# Altium schematic sheet Sheet3.SchDoc
size A2; SheetNumber: 3; SheetTotal: 6
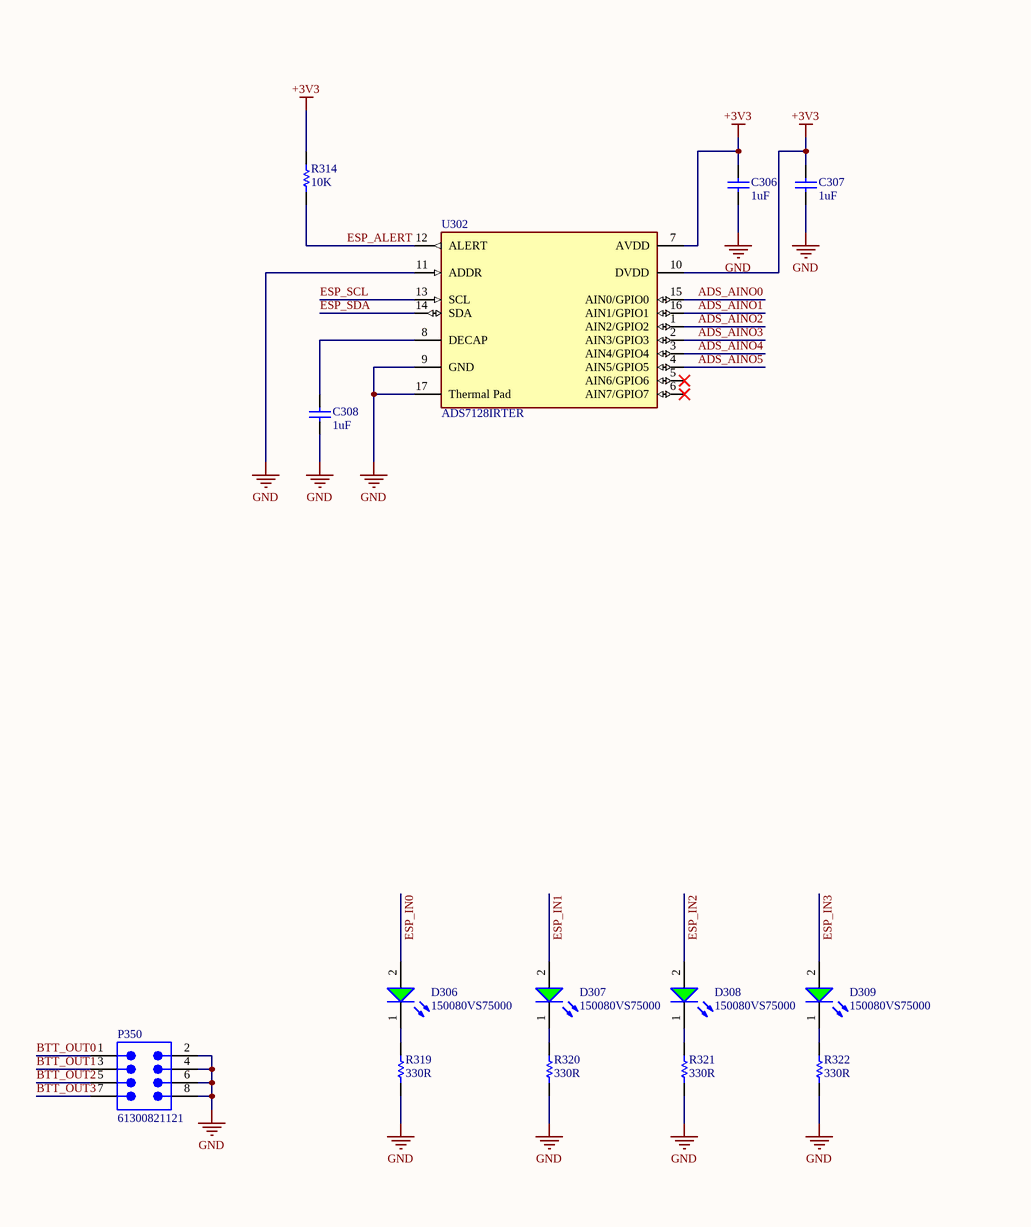
[diagram p0: Sheet3.SchDoc, left]
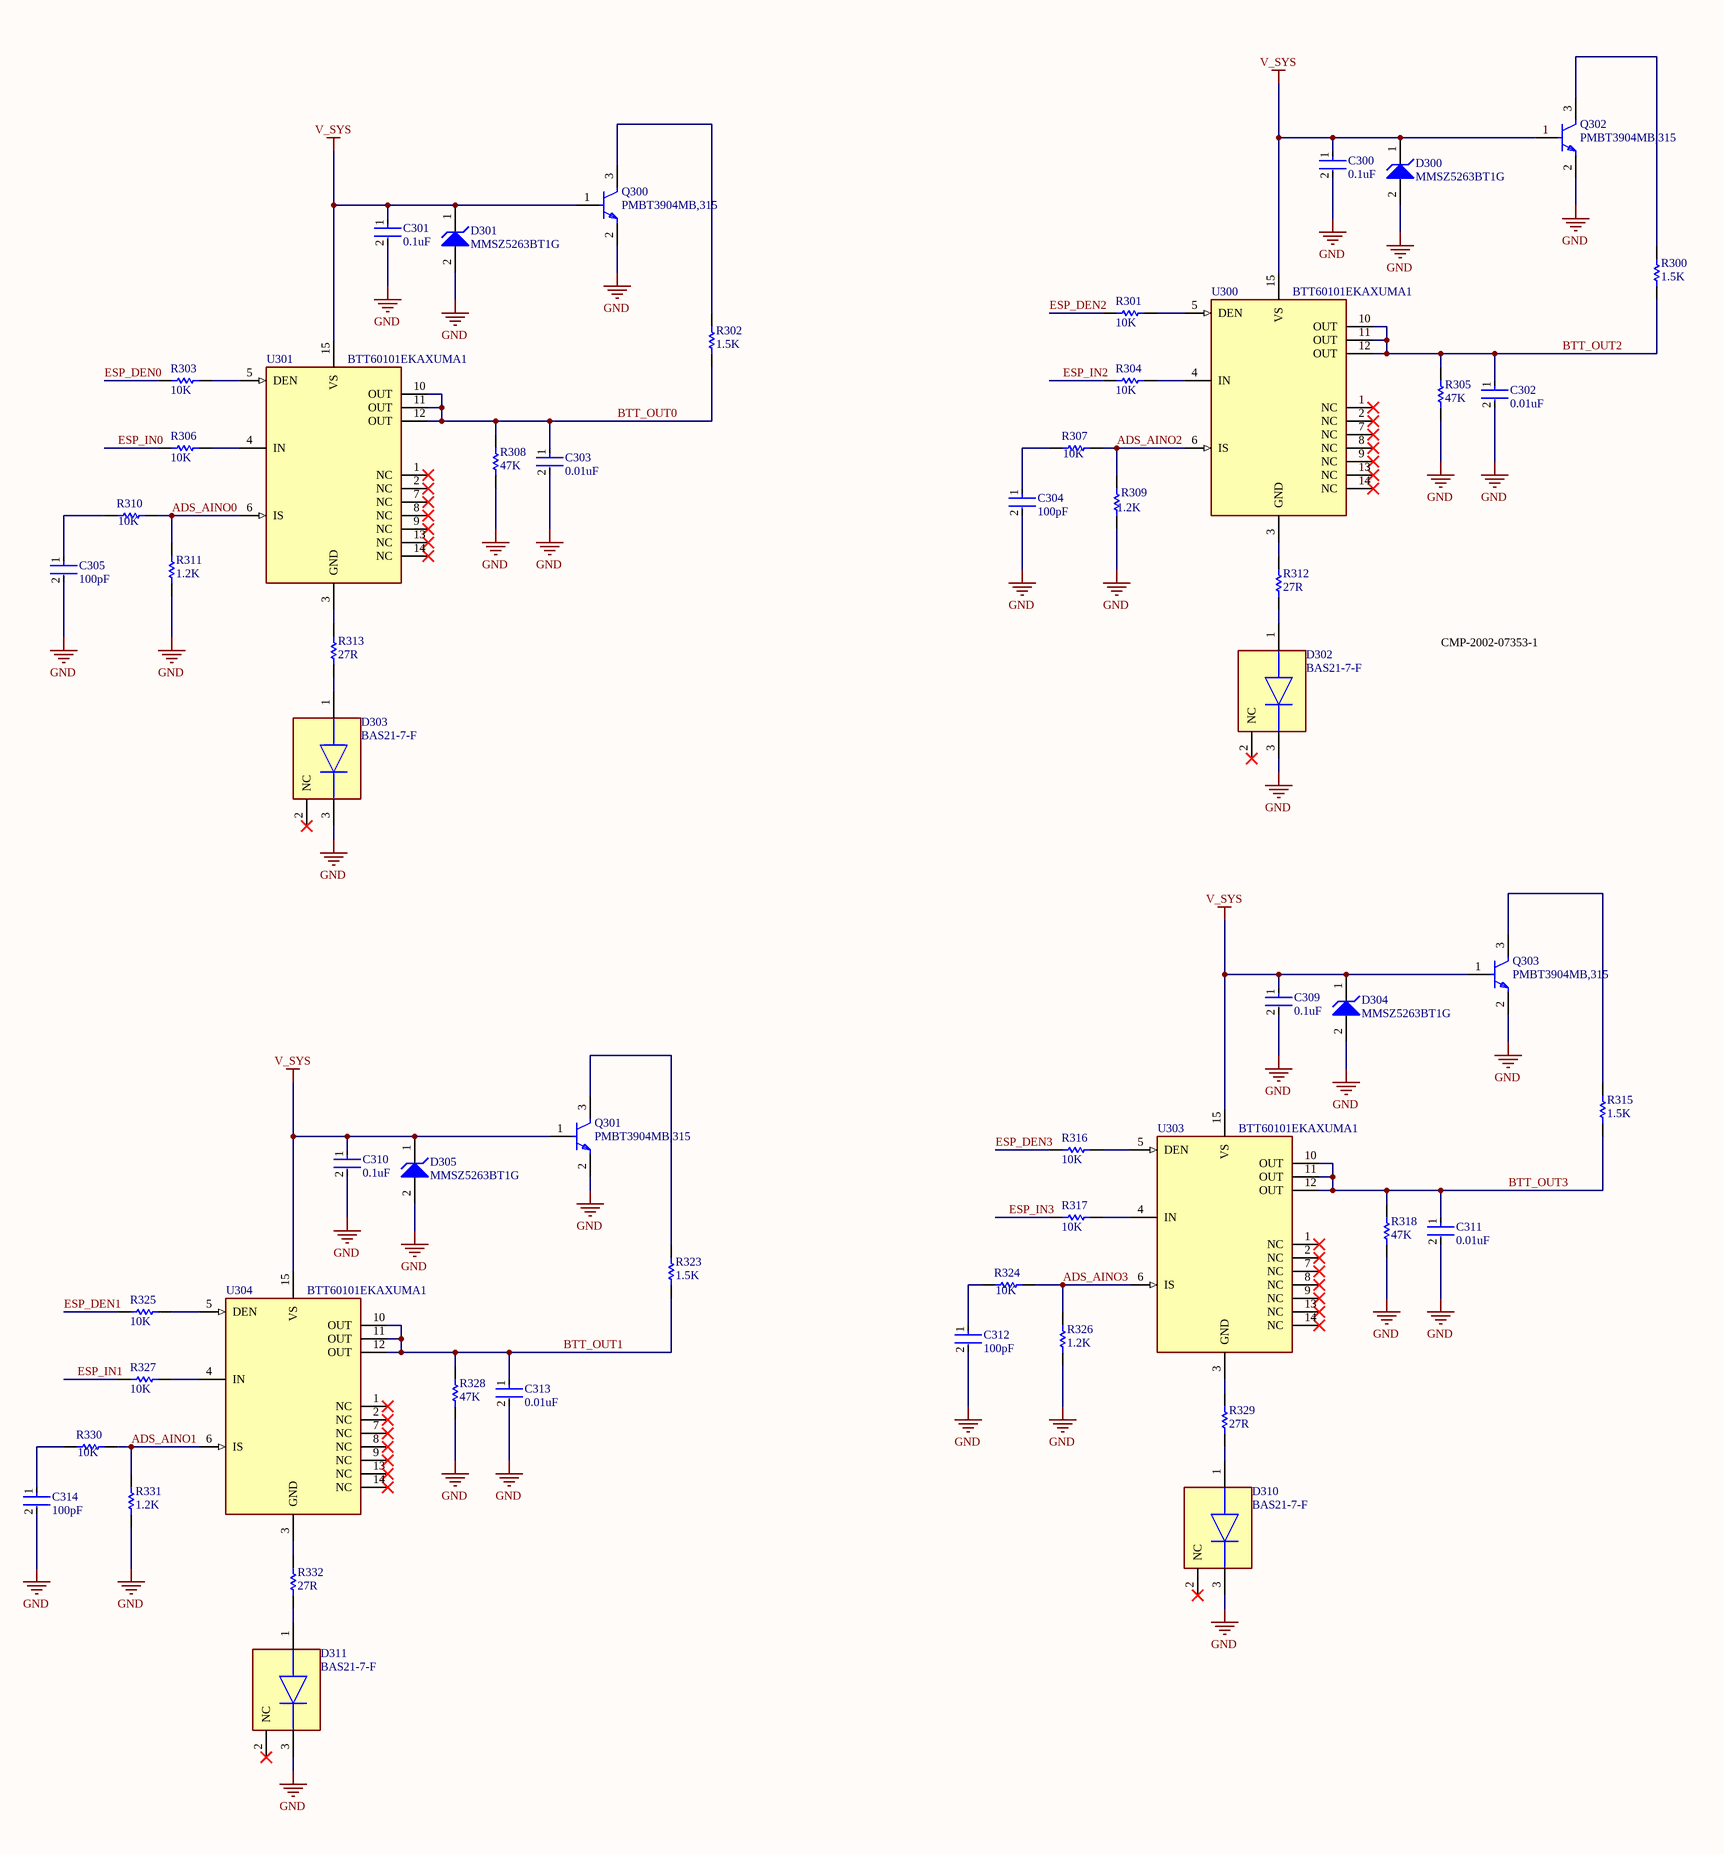
[diagram p1: Sheet3.SchDoc, right]

## Parts
C300  0.1uF  [FP-GRM155-0_05-IPC_B]
C301  0.1uF  [FP-GRM155-0_05-IPC_B]
C302  0.01uF  [FP-GRM155-0_05-IPC_C]
C303  0.01uF  [FP-GRM155-0_05-IPC_C]
C304  100pF  [FP-C0402-BB-MFG]
C305  100pF  [FP-C0402-BB-MFG]
C306  1uF  [CAPC1608X90X35LL10T15]
C307  1uF  [CAPC1608X90X35LL10T15]
C308  1uF  [CAPC1608X90X35LL10T15]
C309  0.1uF  [FP-GRM155-0_05-IPC_B]
C310  0.1uF  [FP-GRM155-0_05-IPC_B]
C311  0.01uF  [FP-GRM155-0_05-IPC_C]
C312  100pF  [FP-C0402-BB-MFG]
C313  0.01uF  [FP-GRM155-0_05-IPC_C]
C314  100pF  [FP-C0402-BB-MFG]
D300  MMSZ5263BT1G  [ONSC-SOD-123-2-425-04_V]
D301  MMSZ5263BT1G  [ONSC-SOD-123-2-425-04_V]
D302  BAS21-7-F  [FP-SOT23-MFG]
D303  BAS21-7-F  [FP-SOT23-MFG]
D304  MMSZ5263BT1G  [ONSC-SOD-123-2-425-04_V]
D305  MMSZ5263BT1G  [ONSC-SOD-123-2-425-04_V]
D306  150080VS75000  [WL-SMCW_0805_150080xx75000]
D307  150080VS75000  [WL-SMCW_0805_150080xx75000]
D308  150080VS75000  [WL-SMCW_0805_150080xx75000]
D309  150080VS75000  [WL-SMCW_0805_150080xx75000]
D310  BAS21-7-F  [FP-SOT23-MFG]
D311  BAS21-7-F  [FP-SOT23-MFG]
P350  61300821121  [61300821121]
Q300  PMBT3904MB,315  [FP-SOT883B-MFG]
Q301  PMBT3904MB,315  [FP-SOT883B-MFG]
Q302  PMBT3904MB,315  [FP-SOT883B-MFG]
Q303  PMBT3904MB,315  [FP-SOT883B-MFG]
R300  1.5K  [RESC1005X40X25ML05T10]
R301  10K  [RESC1005X40X25LL05T10]
R302  1.5K  [RESC1005X40X25ML05T10]
R303  10K  [RESC1005X40X25LL05T10]
R304  10K  [RESC1005X40X25LL05T10]
R305  47K  [RESC1005X40X25ML05T10]
R306  10K  [RESC1005X40X25LL05T10]
R307  10K  [RESC1005X40X25LL05T10]
R308  47K  [RESC1005X40X25ML05T10]
R309  1.2K  [RESC1005X40X25ML05T10]
R310  10K  [RESC1005X40X25LL05T10]
R311  1.2K  [RESC1005X40X25ML05T10]
R312  27R  [RESC1005X40X25LL05T10]
R313  27R  [RESC1005X40X25LL05T10]
R314  10K  [RESC1005X40X25LL05T10]
R315  1.5K  [RESC1005X40X25ML05T10]
R316  10K  [RESC1005X40X25LL05T10]
R317  10K  [RESC1005X40X25LL05T10]
R318  47K  [RESC1005X40X25ML05T10]
R319  330R  [RESC1005X40X25LL05T10]
R320  330R  [RESC1005X40X25LL05T10]
R321  330R  [RESC1005X40X25LL05T10]
R322  330R  [RESC1005X40X25LL05T10]
R323  1.5K  [RESC1005X40X25ML05T10]
R324  10K  [RESC1005X40X25LL05T10]
R325  10K  [RESC1005X40X25LL05T10]
R326  1.2K  [RESC1005X40X25ML05T10]
R327  10K  [RESC1005X40X25LL05T10]
R328  47K  [RESC1005X40X25ML05T10]
R329  27R  [RESC1005X40X25LL05T10]
R330  10K  [RESC1005X40X25LL05T10]
R331  1.2K  [RESC1005X40X25ML05T10]
R332  27R  [RESC1005X40X25LL05T10]
U300  BTT60101EKAXUMA1  [FP-PG-DSO-14-MFG]
U301  BTT60101EKAXUMA1  [FP-PG-DSO-14-MFG]
U302  ADS7128IRTER  [FP-RTE0016C-MFG]
U303  BTT60101EKAXUMA1  [FP-PG-DSO-14-MFG]
U304  BTT60101EKAXUMA1  [FP-PG-DSO-14-MFG]

## Nets
+3V3: C306.2 C307.2 R314.2 U302.7(AVDD) U302.10(DVDD)
GND: C300.2 C301.2 C302.2 C303.2 C304.2 C305.2 C306.1 C307.1 C308.1 C309.2 C310.2 C311.2 C312.2 C313.2 C314.2 D300.2(A) D301.2(A) D302.3(C) D303.3(C) D304.2(A) D305.2(A) D310.3(C) D311.3(C) P350.2 P350.4 P350.6 P350.8 Q300.2(E) Q301.2(E) Q302.2(E) Q303.2(E) R305.1 R308.1 R309.1 R311.1 R318.1 R319.1 R320.1 R321.1 R322.1 R326.1 R328.1 R331.1 U302.9(GND) U302.11(ADDR) U302.17(Thermal_Pad)
V_SYS: C300.1 C301.1 C309.1 C310.1 D300.1(K) D301.1(K) D304.1(K) D305.1(K) Q300.1(B) Q301.1(B) Q302.1(B) Q303.1(B) U300.15(VS) U301.15(VS) U303.15(VS) U304.15(VS)
ADS_AINO0: R310.2 R311.2 U301.6(IS) U302.15(AIN0/GPIO0)
ADS_AINO1: R330.2 R331.2 U302.16(AIN1/GPIO1) U304.6(IS)
ADS_AINO2: R307.2 R309.2 U300.6(IS) U302.1(AIN2/GPIO2)
ADS_AINO3: R324.2 R326.2 U302.2(AIN3/GPIO3) U303.6(IS)
ADS_AINO4: U302.3(AIN4/GPIO4)
ADS_AINO5: U302.4(AIN5/GPIO5)
BTT_OUT0: C303.1 P350.1 R302.1 R308.2 U301.10(OUT) U301.11(OUT) U301.12(OUT)
BTT_OUT1: C313.1 P350.3 R323.1 R328.2 U304.10(OUT) U304.11(OUT) U304.12(OUT)
BTT_OUT2: C302.1 P350.5 R300.1 R305.2 U300.10(OUT) U300.11(OUT) U300.12(OUT)
BTT_OUT3: C311.1 P350.7 R315.1 R318.2 U303.10(OUT) U303.11(OUT) U303.12(OUT)
ESP_ALERT: R314.1 U302.12(ALERT)
ESP_DEN0: R303.2
ESP_DEN1: R325.2
ESP_DEN2: R301.2
ESP_DEN3: R316.2
ESP_IN0: D306.2(A) R306.1
ESP_IN1: D307.2(A) R327.1
ESP_IN2: D308.2(A) R304.1
ESP_IN3: D309.2(A) R317.1
ESP_SCL: U302.13(SCL)
ESP_SDA: U302.14(SDA)
NetC304_1: C304.1 R307.1
NetC305_1: C305.1 R310.1
NetC308_2: C308.2 U302.8(DECAP)
NetC312_1: C312.1 R324.1
NetC314_1: C314.1 R330.1
NetD302_1: D302.1(A) R312.1
NetD303_1: D303.1(A) R313.1
NetD306_1: D306.1(K) R319.2
NetD307_1: D307.1(K) R320.2
NetD308_1: D308.1(K) R321.2
NetD309_1: D309.1(K) R322.2
NetD310_1: D310.1(A) R329.1
NetD311_1: D311.1(A) R332.1
NetQ300_3: Q300.3(C) R302.2
NetQ301_3: Q301.3(C) R323.2
NetQ302_3: Q302.3(C) R300.2
NetQ303_3: Q303.3(C) R315.2
NetR301_1: R301.1 U300.5(DEN)
NetR303_1: R303.1 U301.5(DEN)
NetR304_2: R304.2 U300.4(IN)
NetR306_2: R306.2 U301.4(IN)
NetR312_2: R312.2 U300.3(GND)
NetR313_2: R313.2 U301.3(GND)
NetR316_1: R316.1 U303.5(DEN)
NetR317_2: R317.2 U303.4(IN)
NetR325_1: R325.1 U304.5(DEN)
NetR327_2: R327.2 U304.4(IN)
NetR329_2: R329.2 U303.3(GND)
NetR332_2: R332.2 U304.3(GND)

Not connected (* = marked no-connect by the designer): D302 2(NC)*; D303 2(NC)*; D310 2(NC)*; D311 2(NC)*; U300 1(NC)* 2(NC)* 7(NC)* 8(NC)* 9(NC)* 13(NC)* 14(NC)*; U301 1(NC)* 2(NC)* 7(NC)* 8(NC)* 9(NC)* 13(NC)* 14(NC)*; U302 5(AIN6/GPIO6)* 6(AIN7/GPIO7)*; U303 1(NC)* 2(NC)* 7(NC)* 8(NC)* 9(NC)* 13(NC)* 14(NC)*; U304 1(NC)* 2(NC)* 7(NC)* 8(NC)* 9(NC)* 13(NC)* 14(NC)*

## Notes on the sheet
- CMP-2002-07353-1

## Library data of the parts
C300 C301 C309 C310 = CMP-2008-04639-2: Chip Multilayer Ceramic Capacitors for General Purpose, 0402, 0.10uF, X7R, 15%, 10%, 50V; Dissipation Factor: 0.025%; Capacitance: 100nF; Weight: 0.000212oz; Thickness: 0.022inch; Voltage Rating (DC): 50V; Dielectric Material: Ceramic; Termination: SMD/SMT; Case/Package: 0402; Case Code (Imperial): 0402; Mount: Surface Mount; REACH SVHC: No SVHC; Resistor Type: Ceramic; Dielectric: X7R; Max Operating Temperature: 125°C; Voltage: 50V; Lead Free: Lead Free; Package Quantity: 10000; Packaging: Tape and Reel; Length: 1mm; Material: Ceramic; Height: 0.5mm; Depth: 0.5mm; Width: 0.5mm; Min Operating Temperature: -55°C; Tolerance: 10%; Case Code (Metric): 1005; Voltage Rating: 50V
C302 C303 C311 C313 = CMP-2008-04637-5: Chip Multilayer Ceramic Capacitors for General Purpose, 0402, 10000pF, X7R, 15%, 10%, 50V; Voltage: 25V; Capacitance: 10nF; Tolerance: 10%; Mount: Surface Mount; Lead Free: Lead Free; Radiation Hardening: No; Case Code (Imperial): 0402; REACH SVHC: No SVHC; Case/Package: 0402; Dielectric: X7R; Voltage Rating (DC): 50V; Max Operating Temperature: 125°C; Termination: SMD/SMT; Material: Ceramic; Width: 0.02inch; Package Quantity: 1; Voltage Rating: 50V; Thickness: 0.022inch; Packaging: Tape and Reel; Height: 0.5mm; Number of Pins: 2; Case Code (Metric): 1005; Min Operating Temperature: -55°C; Length: 1mm; Depth: 0.5mm
C304 C305 C312 C314 = CMP-2008-03284-2: CAP CER 100PF 50V C0G/NP0 0402; Manufacturer: Kemet; Manufacturer Part Number: C0402C101J5GACTU; Tolerance: 0.05; Temperature Characteristic: C0G; Temperature Coefficient: 15%; Material: Ceramic; Digikey Description: CAP CER 100PF 50V C0G/NP0 0402; Lead Free: Yes; Capacitance: 100 pF; Device Class L3: Ceramic Capacitors; Mouser Description: Multilayer Ceramic Capacitors MLCC - SMD/SMT 50volts 100pF C0G 5%; Octopart: https://octopart.com/c0402c101j5gactu-kemet-132471; Temperature Range Low: -55°C; Value: 100 pF; Automotive: No; Height: 0.55mm; Category: Cap; ComponentLink2URL: https://content.kemet.com/datasheets/KEM_C1002_X7R_SMD.pdf; RoHS: TRUE; Ipc Land Pattern Name: CAPC10050X50; Temperature Range High: +125°C; Device Class L2: Capacitors; Package: C0402-BB; ComponentLink2Description: Datasheet; Temperature: -55°C to +125°C; Voltage Rating: 50 V; Device Class L1: Passive Components
C306-C308 = CMP-2000-06336-1: Chip Capacitor, 1 uF, +/- 10%, 10 V, -55 to 85 degC, 0603 (1608 Metric), RoHS, Tape and Reel; Manufacturer: Murata; Dielectric: X5R; Voltage Rating: 10V; Case Height: 0.8mm; Temperature Coefficient / Code: +/-15%; Type: GeneralPurposeMLCC; Brand: MurataElectronics; Case Length: 1.6mm; Capacitance - nF: 1000nF; Package Description: 2-Pin Surface Mount Device, Body 1.6 x 0.8 mm; Maximum Operating Temperature: +85C; Minimum Operating Temperature: -55C; Mounting Technology: SurfaceMount; RoHS: Details; Package Reference: 0603; Product: GeneralTypeMLCCs; Packaging: Reel; Case Code - mm: 1608; Manufacturer URL: http://www.murata.com/; Dimensions: 0.8mmWx1.6mmLx0.8mmH; Factory Pack Quantity: 4000; Case Code - in: 0603; Tolerance: 10%; Product Category: MultilayerCeramicCapacitorsMLCC-SMD/SMT; Capacitance: 1uF; Series: GRM; Datasheet Version: 02/2016; Case Width: 0.8mm; Operating Temperature Range: -55Cto+85C; Datasheet URL: http://search.murata.co.jp/Ceramy/image/img/A01X/G101/ENG/GRM188R61A105KA61-01.pdf; Package / Case: 0603(1608metric); Termination Style: SMD/SMT; Voltage Rating DC: 10V
D300 D301 D304 D305 = CMP-1060-00377-1: Zener Voltage Regulator, 500 mW, 2-Pin SOD-123, Pb-Free, Tape and Reel; Manufacturer: On Semiconductor; VZ Typ (V): 56; P Max (W): 0.5; DatasheetVersion: Rev. 12; PackageReference: SOD-123-2-425-04; Mounting Technology: Surface Mount; ComponentLink3URL: http://www.onsemi.com/pub_link/Collateral/425-04.PDF; ComponentLink1Description: Manufacturer URL; ComponentLink3Description: Package Specification; PartNumber: MMSZ5263BT1G; PackageDescription: 2-Pin SOD, Body 1.6 x 2.69 mm; Packing: Tape and Reel; ComponentLink1URL: http://www.onsemi.com/; RoHS: Pb-Free; ComponentLink2Description: Datasheet; ComponentLink2URL: http://www.onsemi.com/pub_link/Collateral/MMSZ5221BT1-D.PDF; PackageVersion: Rev. G, 10/2009
D302 D303 D310 D311 = CMP-12791-000036-1: DIODE GEN PURP 200V 200MA SOT23; Manufacturer: Diodes Inc.; Max Repetitive Reverse Voltage: 250V; Forward Current: 400mA; Max Surge Forward Current: 0.5A; Standoff Height: 0.013mm; Capacitance: 5pF; Max Junction Temp: +150°C; Peak Reverse Current: 0.1uA; Value: 5pF; Device Class L1: Discrete Semiconductors; Category: Diode; Mouser Description: Diodes - General Purpose, Power, Switching 200V 350mW; Digikey Description: DIODE GEN PURP 200V 200MA SOT23; Manufacturer Part Number: BAS21-7-F; Device Class L2: Diodes; RoHS: TRUE; Device Class L3: Rectifier Diodes; Lead Free: Yes; Temperature Range High: +150°C; Ipc Land Pattern Name: SOT92P240X102-3; ComponentLink2Description: Datasheet; Octopart: https://octopart.com/bas21-7-f-diodes+inc.-325943; Reverse Voltage: 200V; Height: 1.1mm; Automotive: No; ComponentLink2URL: https://www.diodes.com/assets/Datasheets/Ds12004.pdf; Temperature: -65°C to +150°C; Temperature Range Low: -65°C; Footprint Url: https://www.diodes.com/assets/Package-Files/SOT23.pdf; Package: SOT23
D306-D309 = CMP-1426-00009-6: WL-SMCW SMT Mono-Color Chip LED Waterclear; Max Junction Temperature (Tj): 95°C; Max Reverse Voltage (DC): 5V; Luminous Intensity: 40mcd; Color: Green; Peak Wavelength: 572nm; Wavelength: 570nm; Viewing Angle: 140°; Power Dissipation: 72mW; Forward Current: 100mA; Test Current: 20mA; Forward Voltage: 2V; Lens Style: Clear, Rectangular; Reverse Voltage: 5V; Length: 2mm; RoHS: Compliant; Min Operating Temperature: -40°C; REACH SVHC: Unknown; Packaging: Tape and Reel; Case/Package: 0805; Max Operating Temperature: 85°C; Case Code (Metric): 2012; Width: 1.25mm; Dominant Wavelength: 570nm; Mount: Surface Mount; Case Code (Imperial): 0805; Height: 700µm
P350 = CMP-1502-01078-4: THT Vertical Pin Header WR-PHD, Pitch 2.54 mm, Dual Row, 8 pins; Number of Contacts: 8; Gender: Male; Connector Type: Male Pin; Current Rating: 3A; Row Spacing: 2.54mm; Contact Resistance: 20mΩ; Voltage Rating: 250V; Number of Pins: 8; Lead Pitch: 2.54mm; Mount: Through Hole; Lead Free: Lead Free; Contact Material: Gold; Number of Positions: 8; Min Operating Temperature: -40°C; RoHS: Compliant; Termination: Solder; Packaging: Bulk; Max Operating Temperature: 105°C; Operating Supply Voltage: 250V; Contact Mating Length: 5.9944mm; Height: 8.89mm; Color: Black; Pitch: 2.54mm; Number of Rows: 2; Orientation: Vertical; Contact Plating: Gold
Q300-Q303 = CMP-14406-000022-1: TRANS NPN 40V 0.2A 3DFN
R300 R302 R315 R323 = CMP-2002-07464-1: Manufacturer: Yageo / Phycomp; Part Number: RC0402FR-071K5L
R301 R303 R304 R306 R307 R310 R314 R316 R317 R324 R325 R327 R330 = CMP-2002-07353-1: Part Number: RC0402FR-0710KL; Manufacturer: Yageo / Phycomp
R305 R308 R318 R328 = CMP-2002-07701-1: Part Number: RC0402FR-0747KL; Manufacturer: Yageo / Phycomp
R309 R311 R326 R331 = CMP-2002-07456-1: Part Number: RC0402FR-071K2L; Manufacturer: Yageo / Phycomp
R312 R313 R329 R332 = CMP-2002-07055-1: Part Number: RC0402FR-0727RL; Manufacturer: Yageo / Phycomp
R319-R322 = CMP-2002-07613-1: Thick Film Resistors - SMD General Purpose Chip Resistor 0402, 330 Ohms, 1%, 1/16W; Part Number: RC0402FR-07330RL; Manufacturer: Yageo / Phycomp; Supplier: Farnell; Supplier Part Number: RC0402FR-07330RL
U300 U301 U303 U304 = CMP-32849-000085-1: IC PWR SWITCH N-CHAN 1:1 DSO-14; Fault Protection: Over Voltage; Max Supply Voltage: 36V; Supply Current: 2mA; Interface: On/Off; Output Configuration: High Side; Max Power Dissipation: 1.6W; Number of Outputs: 1; Max Output Current: 9A; RoHS Compliant: Yes; Series: -; Max Operating Temperature: 150°C; Lead Free: Lead Free; Number of Channels: 1; Nominal Supply Current: 2mA; Min Operating Temperature: -40°C; Mount: Surface Mount; Packaging: Cut Tape; Number of Pins: 14; Halogen Free: Halogen Free
U302 = CMP-04860-000052-2: IC ADC 12BIT SAR 16WQFN; Manufacturer Lifecycle Status: ACTIVE; NexarPartId: 103121062; Max Supply Voltage: 5.5V; Number of Converters: 1; Min Supply Voltage: 1.65V; Interface: I2C; Max Junction Temperature (Tj): 125°C; Number of Channels: 8; Height: 800µm; Lifecycle Status: Production; Width: 3mm; Thickness: 750µm; Min Operating Temperature: -40°C; Number of Pins: 16; Ambient Temperature Range High: 85°C; Max Operating Temperature: 85°C; Length: 3mm